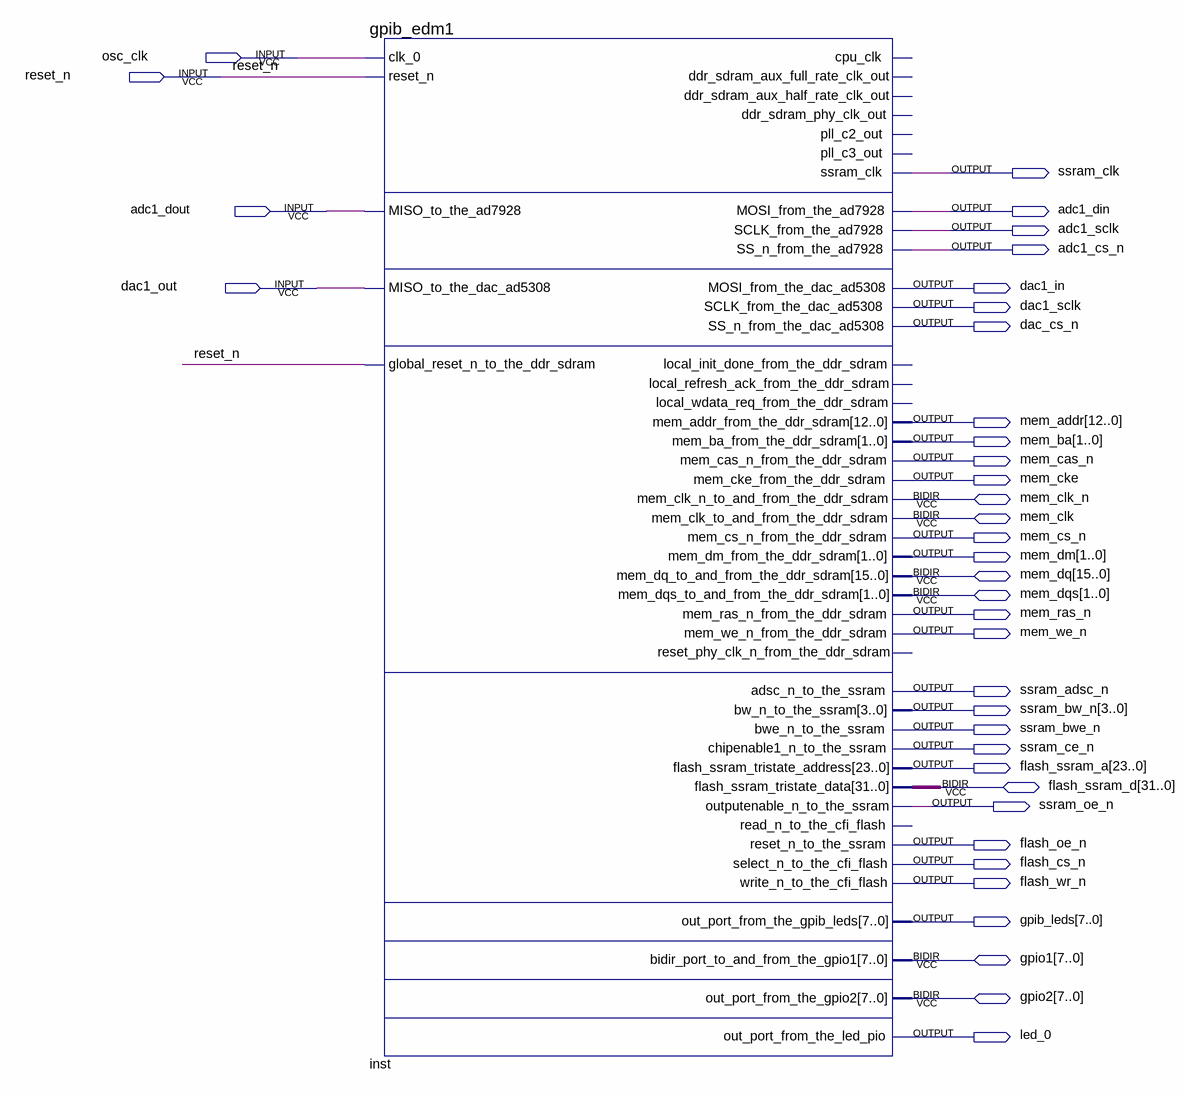
[diagram p0: schematic sheet]
// Quartus schematic interface1.bdf as structural Verilog: 1 symbols, 37 pins
module interface1 (
  input  osc_clk,
  input  reset_n,
  input  adc1_dout,
  input  dac1_out,
  inout  mem_clk_n,
  inout  mem_clk,
  inout  [15:0] mem_dq,
  inout  [1:0] mem_dqs,
  inout  [31:0] flash_ssram_d,
  inout  [7:0] gpio1,
  inout  [7:0] gpio2,
  output ssram_clk,
  output adc1_din,
  output adc1_sclk,
  output adc1_cs_n,
  output dac1_in,
  output dac1_sclk,
  output dac_cs_n,
  output [12:0] mem_addr,
  output [1:0] mem_ba,
  output mem_cas_n,
  output mem_cke,
  output mem_cs_n,
  output [1:0] mem_dm,
  output mem_ras_n,
  output mem_we_n,
  output ssram_adsc_n,
  output [3:0] ssram_bw_n,
  output ssram_bwe_n,
  output ssram_ce_n,
  output [23:0] flash_ssram_a,
  output ssram_oe_n,
  output flash_oe_n,
  output flash_cs_n,
  output flash_wr_n,
  output [7:0] gpib_leds,
  output led_0
);

  gpib_edm1 inst (
    .clk_0(osc_clk), .reset_n(reset_n), .MISO_to_the_ad7928(adc1_dout), .MISO_to_the_dac_ad5308(dac1_out),
    .global_reset_n_to_the_ddr_sdram(reset_n), .ssram_clk(ssram_clk), .MOSI_from_the_ad7928(adc1_din),
    .SCLK_from_the_ad7928(adc1_sclk), .SS_n_from_the_ad7928(adc1_cs_n), .MOSI_from_the_dac_ad5308(dac1_in),
    .SCLK_from_the_dac_ad5308(dac1_sclk), .SS_n_from_the_dac_ad5308(dac_cs_n),
    .mem_addr_from_the_ddr_sdram(mem_addr), .mem_ba_from_the_ddr_sdram(mem_ba),
    .mem_cas_n_from_the_ddr_sdram(mem_cas_n), .mem_cke_from_the_ddr_sdram(mem_cke),
    .mem_cs_n_from_the_ddr_sdram(mem_cs_n), .mem_dm_from_the_ddr_sdram(mem_dm),
    .mem_ras_n_from_the_ddr_sdram(mem_ras_n), .mem_we_n_from_the_ddr_sdram(mem_we_n),
    .adsc_n_to_the_ssram(ssram_adsc_n), .bw_n_to_the_ssram(ssram_bw_n), .bwe_n_to_the_ssram(ssram_bwe_n),
    .chipenable1_n_to_the_ssram(ssram_ce_n), .flash_ssram_tristate_address(flash_ssram_a),
    .outputenable_n_to_the_ssram(ssram_oe_n), .reset_n_to_the_ssram(flash_oe_n),
    .select_n_to_the_cfi_flash(flash_cs_n), .write_n_to_the_cfi_flash(flash_wr_n),
    .out_port_from_the_gpib_leds(gpib_leds), .out_port_from_the_gpio2(gpio2),
    .out_port_from_the_led_pio(led_0), .mem_clk_n_to_and_from_the_ddr_sdram(mem_clk_n),
    .mem_clk_to_and_from_the_ddr_sdram(mem_clk), .mem_dq_to_and_from_the_ddr_sdram(mem_dq),
    .mem_dqs_to_and_from_the_ddr_sdram(mem_dqs), .flash_ssram_tristate_data(flash_ssram_d),
    .bidir_port_to_and_from_the_gpio1(gpio1));  // open: cpu_clk, ddr_sdram_aux_full_rate_clk_out, ddr_sdram_aux_half_rate_clk_out, ddr_sdram_phy_clk_out, pll_c2_out, pll_c3_out, local_init_done_from_the_ddr_sdram, local_refresh_ack_from_the_ddr_sdram, local_wdata_req_from_the_ddr_sdram, reset_phy_clk_n_from_the_ddr_sdram, read_n_to_the_cfi_flash
endmodule
